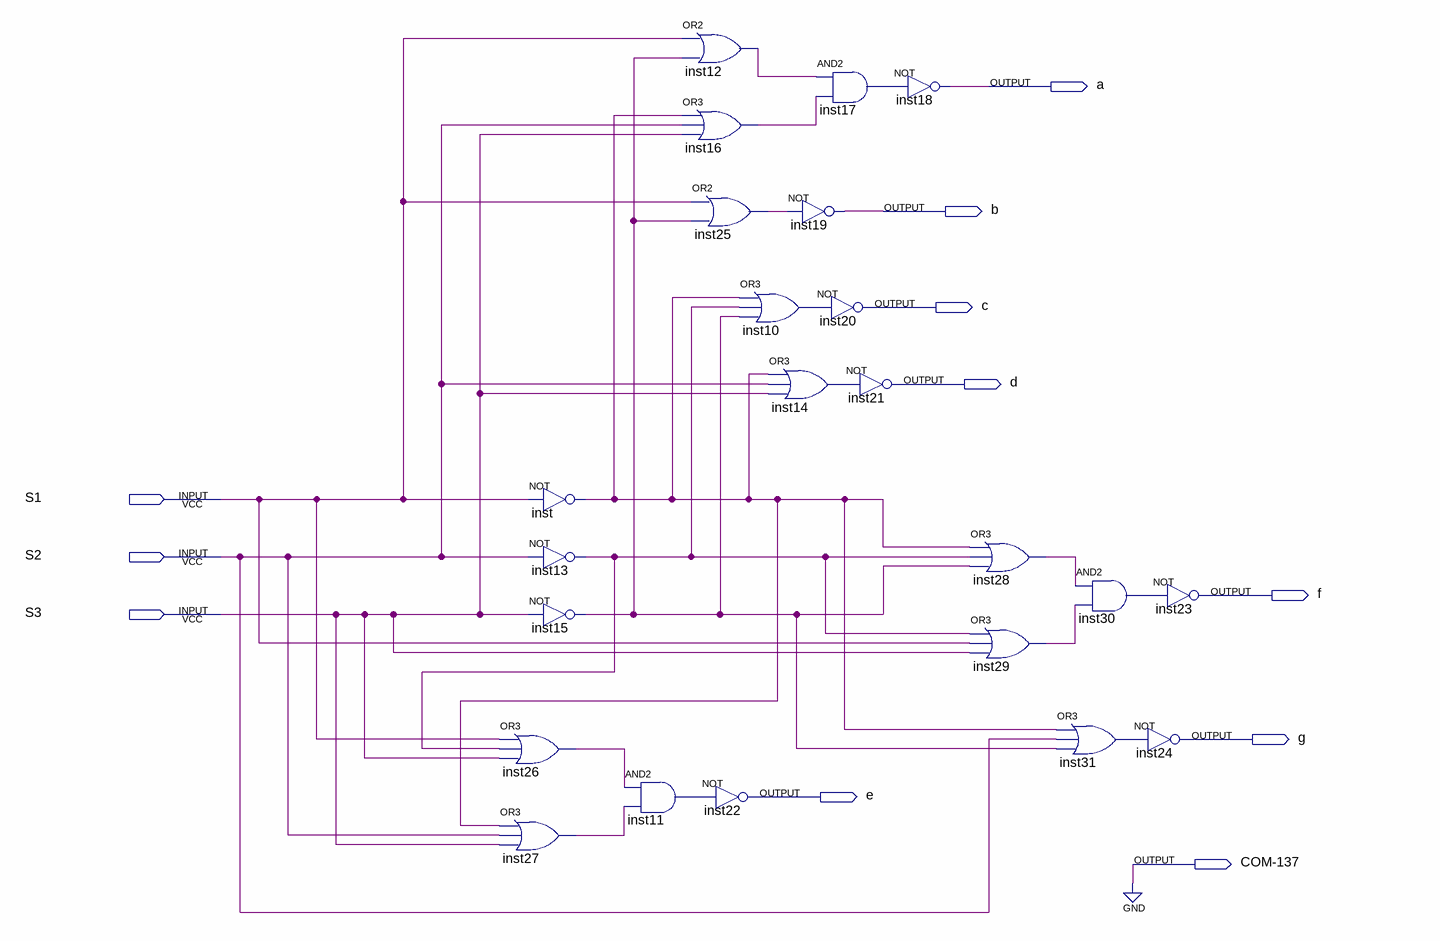
[diagram p0: schematic sheet]
// Quartus schematic Quiz-phone_number-180608.bdf as structural Verilog: 23 symbols, 11 pins
module \Quiz-phone_number-180608  (
  input  S1,
  input  S2,
  input  S3,
  output a,
  output b,
  output c,
  output d,
  output f,
  output g,
  output e,
  output \COM-137 
);

  wire inst10_out, inst11_out, inst12_out, inst13_out, inst14_out, inst15_out, inst16_out, inst17_out,
       inst25_out, inst26_out, inst27_out, inst28_out, inst29_out, inst30_out, inst31_out, inst_out;

  or inst26 (inst26_out, S1, inst13_out, S3);
  or inst27 (inst27_out, inst_out, S2, S3);
  not inst (inst_out, S1);
  not inst13 (inst13_out, S2);
  not inst15 (inst15_out, S3);
  and inst11 (inst11_out, inst26_out, inst27_out);
  or inst12 (inst12_out, S1, inst15_out);
  or inst16 (inst16_out, inst_out, S2, S3);
  or inst25 (inst25_out, S1, inst15_out);
  or inst10 (inst10_out, inst_out, inst13_out, inst15_out);
  not inst22 (e, inst11_out);
  and inst17 (inst17_out, inst12_out, inst16_out);
  not inst19 (b, inst25_out);
  not inst20 (c, inst10_out);
  or inst14 (inst14_out, inst_out, S2, S3);
  not inst18 (a, inst17_out);
  not inst21 (d, inst14_out);
  or inst28 (inst28_out, inst_out, inst13_out, inst15_out);
  or inst29 (inst29_out, inst13_out, S1, S3);
  and inst30 (inst30_out, inst28_out, inst29_out);
  or inst31 (inst31_out, inst_out, S2, inst15_out);
  not inst23 (f, inst30_out);
  not inst24 (g, inst31_out);

  assign \COM-137  = 1'b0;
endmodule
